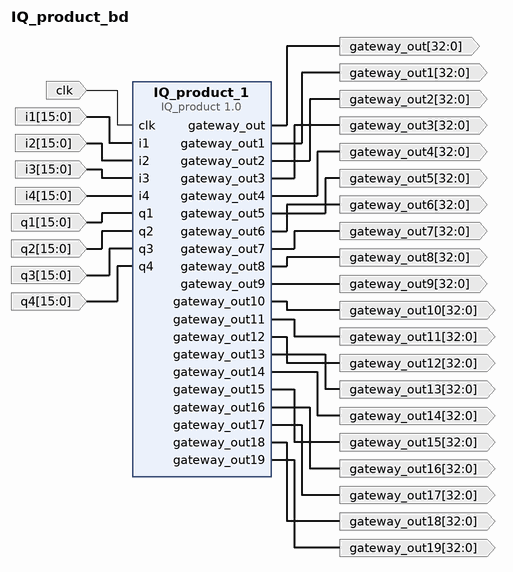
[diagram p0: block diagram of the top level]
# Vivado block design IQ_product_bd, xczu48dr-ffvg1517-2-e, Vivado 2022.2.2
create_bd_design IQ_product_bd

create_bd_port -dir I -type clk clk
create_bd_port -dir O -from 32 -to 0 -type data gateway_out
create_bd_port -dir O -from 32 -to 0 -type data gateway_out1
create_bd_port -dir O -from 32 -to 0 -type data gateway_out10
create_bd_port -dir O -from 32 -to 0 -type data gateway_out11
create_bd_port -dir O -from 32 -to 0 -type data gateway_out12
create_bd_port -dir O -from 32 -to 0 -type data gateway_out13
create_bd_port -dir O -from 32 -to 0 -type data gateway_out14
create_bd_port -dir O -from 32 -to 0 -type data gateway_out15
create_bd_port -dir O -from 32 -to 0 -type data gateway_out16
create_bd_port -dir O -from 32 -to 0 -type data gateway_out17
create_bd_port -dir O -from 32 -to 0 -type data gateway_out18
create_bd_port -dir O -from 32 -to 0 -type data gateway_out19
create_bd_port -dir O -from 32 -to 0 -type data gateway_out2
create_bd_port -dir O -from 32 -to 0 -type data gateway_out3
create_bd_port -dir O -from 32 -to 0 -type data gateway_out4
create_bd_port -dir O -from 32 -to 0 -type data gateway_out5
create_bd_port -dir O -from 32 -to 0 -type data gateway_out6
create_bd_port -dir O -from 32 -to 0 -type data gateway_out7
create_bd_port -dir O -from 32 -to 0 -type data gateway_out8
create_bd_port -dir O -from 32 -to 0 -type data gateway_out9
create_bd_port -dir I -from 15 -to 0 -type data i1
create_bd_port -dir I -from 15 -to 0 -type data i2
create_bd_port -dir I -from 15 -to 0 -type data i3
create_bd_port -dir I -from 15 -to 0 -type data i4
create_bd_port -dir I -from 15 -to 0 -type data q1
create_bd_port -dir I -from 15 -to 0 -type data q2
create_bd_port -dir I -from 15 -to 0 -type data q3
create_bd_port -dir I -from 15 -to 0 -type data q4

create_bd_cell -type ip -vlnv Technion:VMC:IQ_product:1.0 IQ_product_1

# ---- connections ----

connect_bd_net [get_bd_pins IQ_product_1/gateway_out] [get_bd_ports gateway_out]
connect_bd_net [get_bd_pins IQ_product_1/gateway_out1] [get_bd_ports gateway_out1]
connect_bd_net [get_bd_pins IQ_product_1/gateway_out2] [get_bd_ports gateway_out2]
connect_bd_net [get_bd_pins IQ_product_1/gateway_out3] [get_bd_ports gateway_out3]
connect_bd_net [get_bd_pins IQ_product_1/gateway_out4] [get_bd_ports gateway_out4]
connect_bd_net [get_bd_pins IQ_product_1/gateway_out5] [get_bd_ports gateway_out5]
connect_bd_net [get_bd_pins IQ_product_1/gateway_out6] [get_bd_ports gateway_out6]
connect_bd_net [get_bd_pins IQ_product_1/gateway_out7] [get_bd_ports gateway_out7]
connect_bd_net [get_bd_pins IQ_product_1/gateway_out8] [get_bd_ports gateway_out8]
connect_bd_net [get_bd_pins IQ_product_1/gateway_out9] [get_bd_ports gateway_out9]
connect_bd_net [get_bd_pins IQ_product_1/gateway_out10] [get_bd_ports gateway_out10]
connect_bd_net [get_bd_pins IQ_product_1/gateway_out11] [get_bd_ports gateway_out11]
connect_bd_net [get_bd_pins IQ_product_1/gateway_out12] [get_bd_ports gateway_out12]
connect_bd_net [get_bd_pins IQ_product_1/gateway_out13] [get_bd_ports gateway_out13]
connect_bd_net [get_bd_pins IQ_product_1/gateway_out14] [get_bd_ports gateway_out14]
connect_bd_net [get_bd_pins IQ_product_1/gateway_out15] [get_bd_ports gateway_out15]
connect_bd_net [get_bd_pins IQ_product_1/gateway_out16] [get_bd_ports gateway_out16]
connect_bd_net [get_bd_pins IQ_product_1/gateway_out17] [get_bd_ports gateway_out17]
connect_bd_net [get_bd_pins IQ_product_1/gateway_out18] [get_bd_ports gateway_out18]
connect_bd_net [get_bd_pins IQ_product_1/gateway_out19] [get_bd_ports gateway_out19]
connect_bd_net [get_bd_ports clk] [get_bd_pins IQ_product_1/clk]
connect_bd_net -net i1_1 [get_bd_ports i1] [get_bd_pins IQ_product_1/i1]
connect_bd_net -net i2_1 [get_bd_ports i2] [get_bd_pins IQ_product_1/i2]
connect_bd_net -net i3_1 [get_bd_ports i3] [get_bd_pins IQ_product_1/i3]
connect_bd_net -net i4_1 [get_bd_ports i4] [get_bd_pins IQ_product_1/i4]
connect_bd_net -net q1_1 [get_bd_ports q1] [get_bd_pins IQ_product_1/q1]
connect_bd_net -net q2_1 [get_bd_ports q2] [get_bd_pins IQ_product_1/q2]
connect_bd_net -net q3_1 [get_bd_ports q3] [get_bd_pins IQ_product_1/q3]
connect_bd_net -net q4_1 [get_bd_ports q4] [get_bd_pins IQ_product_1/q4]

validate_bd_design
save_bd_design
